# EAGLE design KONNEKTING HW1.1 Rev0 (EAGLE 7.4.0)

## Sheet 1 of 3
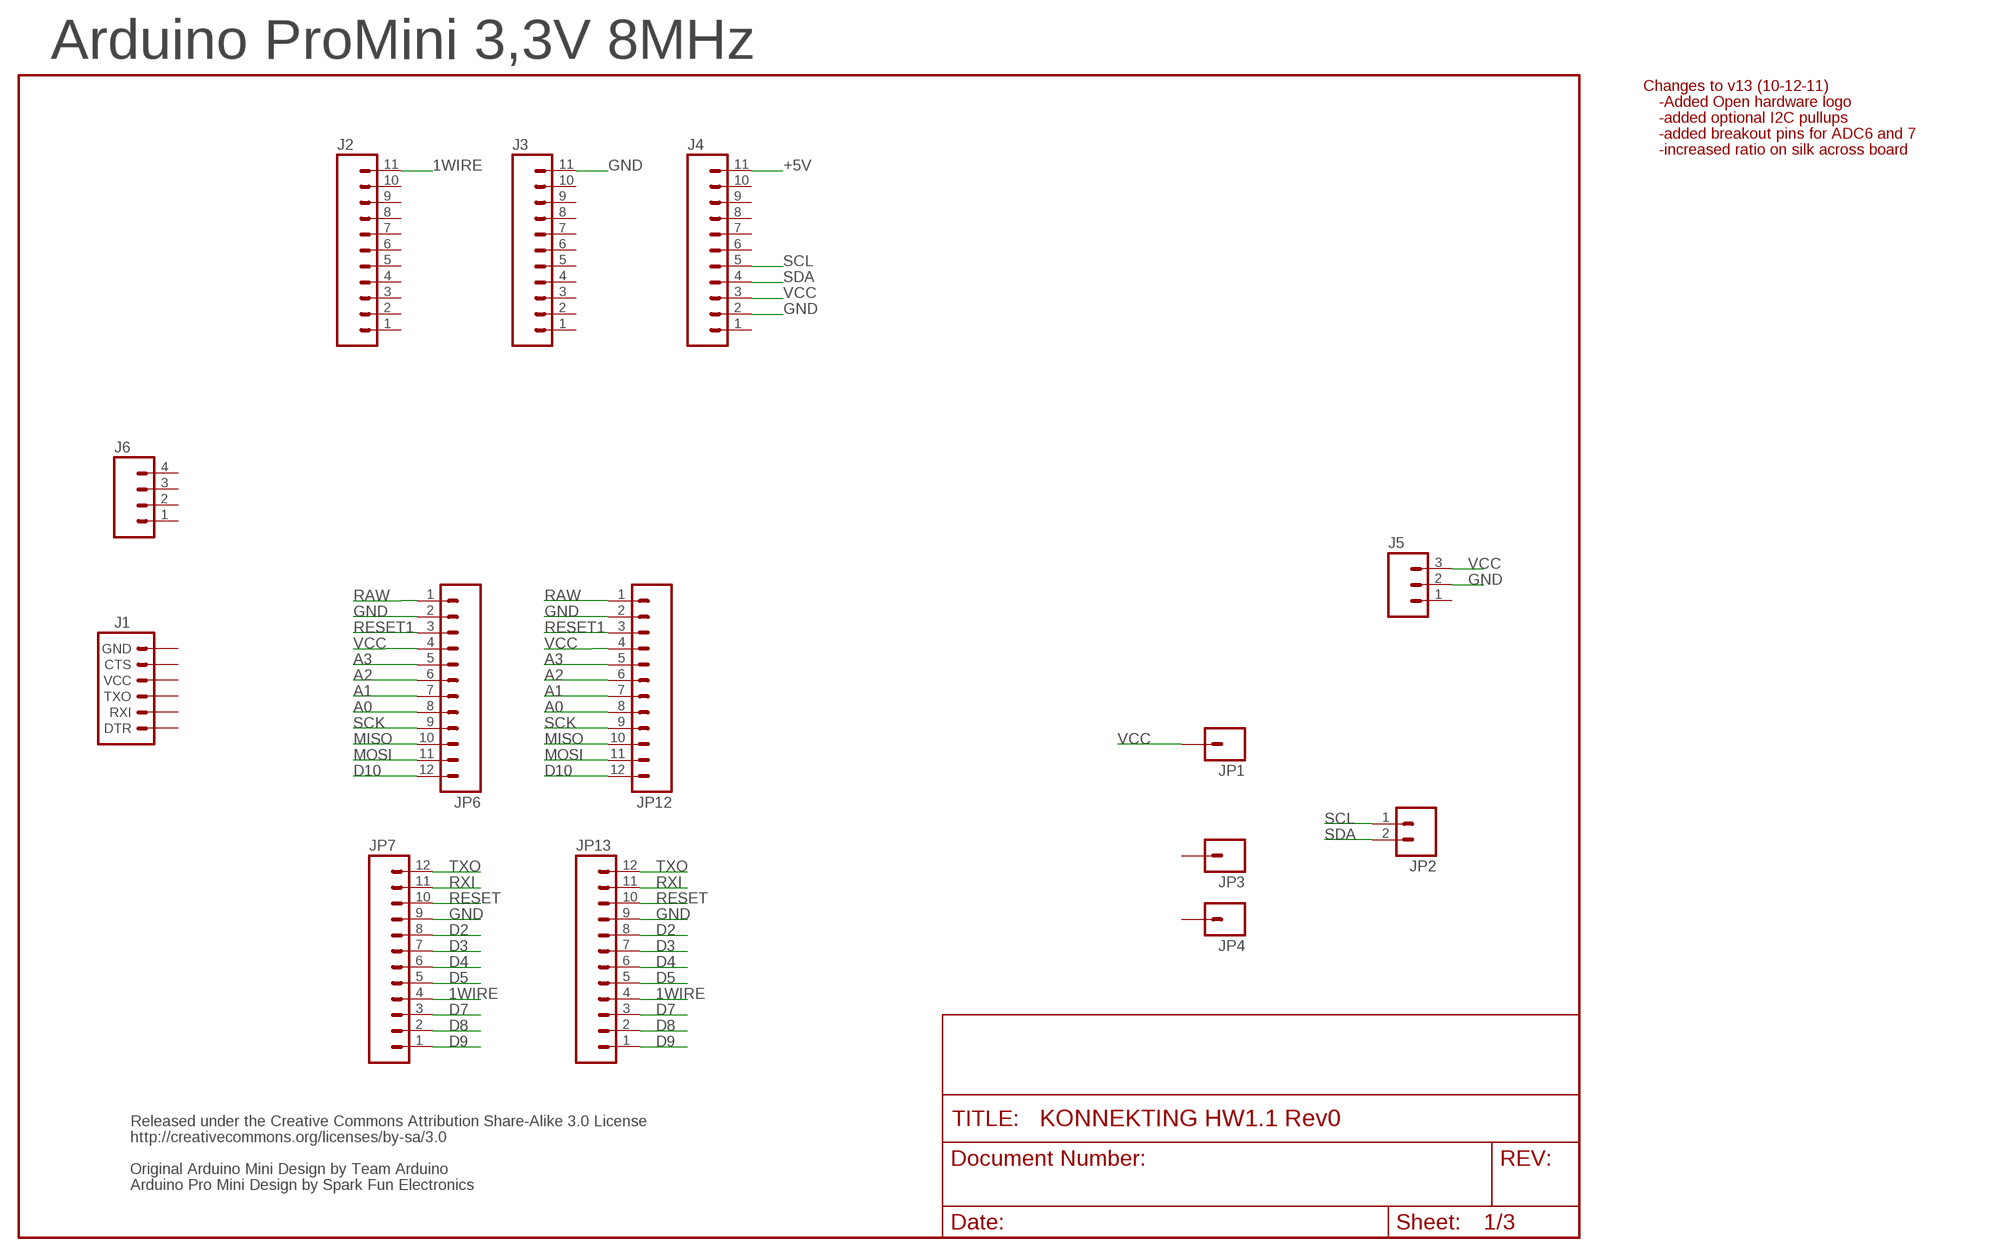
[diagram p0: schematic, sheet 1]

### Parts
J1  ARDUINO_SERIAL_PROGRAMPTH  [1X06]
J2  M11PTH  [1X11]
J3  M11PTH  [1X11]
J4  M11PTH  [1X11]
J5  M03PTH  [1X03]
J6  M04PTH  [1X04]
JP1  M01PTH  [1X01]
JP2  M02PTH  [1X02]
JP3  M01PTH  [1X01]
JP4  M01PTH  [1X01]
JP6  M12PTH  [1X12]
JP7  M12PTH  [1X12]
JP12  M12PTH  [1X12]
JP13  M12PTH  [1X12]

### Nets
1WIRE: J2.11 JP7.4 JP13.4 ; also sheet 3
+5V: J4.11 ; also sheet 2,3
A0: JP6.8 JP12.8
A1: JP6.7 JP12.7
A2: JP6.6 JP12.6
A3: JP6.5 JP12.5
D2: JP7.8 JP13.8 ; also sheet 3
D3: JP7.7 JP13.7 ; also sheet 3
D4: JP7.6 JP13.6
D5: JP7.5 JP13.5
D7: JP7.3 JP13.3 ; also sheet 3
D8: JP7.2 JP13.2 ; also sheet 3
D9: JP7.1 JP13.1 ; also sheet 3
D10: JP6.12 JP12.12
GND: J3.11 J4.2 J5.2 JP6.2 JP7.9 JP12.2 JP13.9 ; also sheet 2,3
MISO: JP6.10 JP12.10
MOSI: JP6.11 JP12.11
RAW: JP6.1 JP12.1
RESET: JP7.10 JP13.10
RESET1: JP6.3 JP12.3
RXI: JP7.11 JP13.11 ; also sheet 3
SCK: JP6.9 JP12.9
SCL: J4.5 JP2.1
SDA: J4.4 JP2.2
TXO: JP7.12 JP13.12 ; also sheet 3
VCC: J4.3 J5.3 JP1.1 JP6.4 JP12.4 ; also sheet 3
Unconnected: J1.1(DTR) J1.2(RXI) J1.3(TXO) J1.4(VCC) J1.5(CTS) J1.6(GND) J2.1 J2.2 J2.3 J2.4 J2.5 J2.6 J2.7 J2.8 J2.9 J2.10 J3.1 J3.2 J3.3 J3.4 J3.5 J3.6 J3.7 J3.8 J3.9 J3.10 J4.1 J4.6 J4.7 J4.8 J4.9 J4.10 J5.1 J6.1 J6.2 J6.3 J6.4 JP3.1 JP4.1

### Notes on the sheet
- Arduino ProMini 3,3V 8MHz
- Changes to v13 (10-12-11)
- -Added Open hardware logo
- -added optional I2C pullups
- -added breakout pins for ADC6 and 7
- -increased ratio on silk across board
- Released under the Creative Commons Attribution Share-Alike 3.0 License
- http://creativecommons.org/licenses/by-sa/3.0
- Original Arduino Mini Design by Team Arduino
- Arduino Pro Mini Design by Spark Fun Electronics

## Sheet 2 of 3
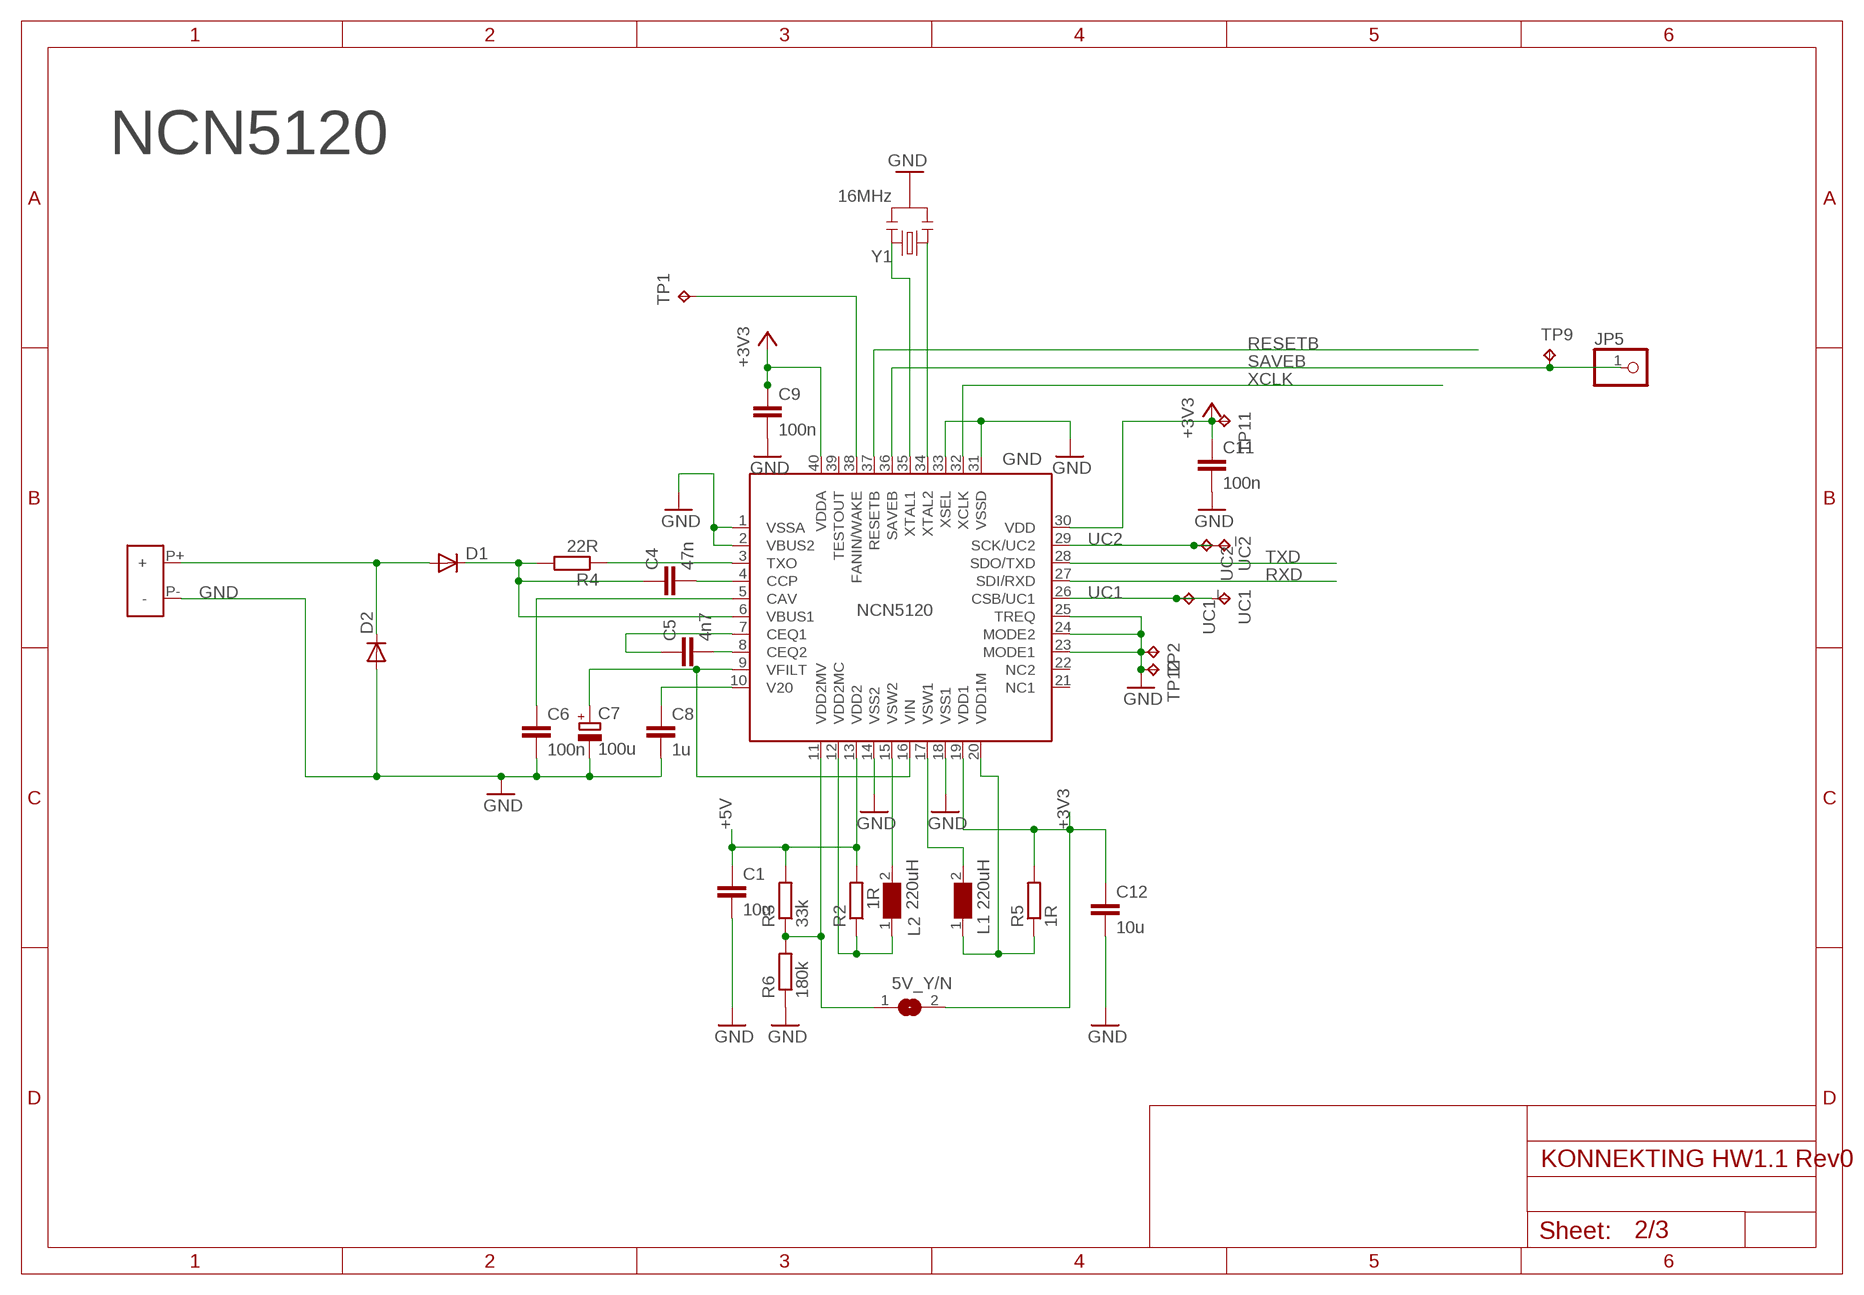
[diagram p1: schematic, sheet 2]

### Parts
5V_Y/N  SJ  [SJ]
C1  10u  C-EUC0805  [C0805]
C4  47n  C-EUC0603  [C0603]
C5  4n7  C-EUC0603  [C0603]
C6  100n  C-EUC0603  [C0603]
C7  100u  CPOL-EUUD-6,3X7,7  [UD-6,3X7,7_NICHICON]
C8  1u  C-EUC0603  [C0603]
C9  100n  C-EUC0603  [C0603]
C11  100n  C-EUC0603  [C0603]
C12  10u  C-EUC0805  [C0805]
D1  DIODESMA-ALT  [SMA-DIODE_ALT]
D2  DIODESMA-ALT  [SMA-DIODE_ALT]
GND  NCN5120_KNX_TRANSCEIVER  [QFN40]
JP5  PINHD-1X1  [1X01]
L1  220uH  WE-PD2_7850  [WE-PD2_7850]
L2  220uH  WE-PD2_7850  [WE-PD2_7850]
R2  1R  R-EU_R0603  [R0603]
R3  33k  R-EU_R0603  [R0603]
R4  22R  R-EU_R2512  [R2512]
R5  1R  R-EU_R0603  [R0603]
R6  180k  R-EU_R0603  [R0603]
TP1  TPTP10SQ  [TP10SQ]
TP2  TPTP09SQ  [TP09SQ]
TP9  TPTP10SQ  [TP10SQ]
TP11  TPTP09SQ  [TP09SQ]
TP12  TPTP09SQ  [TP09SQ]
U$2  KNX_KLEMME  [KNX_KLEMME]
UC1  TPTP09SQ  [TP09SQ]
UC1_  TPTP09SQ  [TP09SQ]
UC2  TPTP09SQ  [TP09SQ]
UC2_  TPTP09SQ  [TP09SQ]
Y1  16MHz  RESONATORSMD  [RESONATOR-SMD]

### Nets
+3V3: 5V_Y/N.2 C9.1 C11.1 C12.1 GND.19(VDD1) GND.30(VDD) GND.40(VDDA) R5.2 TP11.TP ; also sheet 3
+5V: C1.1 GND.13(VDD2) R2.2 R3.2 ; also sheet 1,3
GND: C1.2 C6.2 C7.- C8.2 C9.2 C11.2 C12.2 D2.A GND.1(VSSA) GND.2(VBUS2) GND.14(VSS2) GND.18(VSS1) GND.23(MODE1) GND.24(MODE2) GND.25(TREQ) GND.31(VSSD) GND.33(XSEL) R6.1 TP2.TP TP12.TP U$2.P-(-) Y1.2 ; also sheet 1,3
N$1: 5V_Y/N.1 GND.11(VDD2MV) R3.1 R6.2
N$3: GND.3(TXO) R4.1
N$4: C4.1 D1.C GND.6(VBUS1) R4.2
N$5: C5.1 GND.7(CEQ1)
N$6: C7.+ GND.9(VFILT) GND.16(VIN)
N$7: GND.15(VSW2) L2.2
N$8: C8.1 GND.10(V20)
N$9: C6.1 GND.5(CAV)
N$10: C4.2 GND.4(CCP)
N$11: C5.2 GND.8(CEQ2)
N$12: D1.A D2.C U$2.P+(+)
N$14: GND.38(FANIN/WAKE) TP1.TP
N$16: GND.12(VDD2MC) L2.1 R2.1
N$17: GND.35(XTAL1) Y1.3
N$18: GND.34(XTAL2) Y1.1
N$22: GND.17(VSW1) L1.2
N$24: GND.20(VDD1M) L1.1 R5.1
RESETB: GND.37(RESETB)
RXD: GND.27(SDI/RXD) ; also sheet 3
SAVEB: GND.36(SAVEB) JP5.1 TP9.TP
TXD: GND.28(SDO/TXD) ; also sheet 3
UC1: GND.26(CSB/UC1) UC1.TP UC1_.TP
UC2: GND.29(SCK/UC2) UC2.TP UC2_.TP
XCLK: GND.32(XCLK)
Unconnected: GND.21(NC1) GND.22(NC2) GND.39(TESTOUT)

### Notes on the sheet
- NCN5120

## Sheet 3 of 3
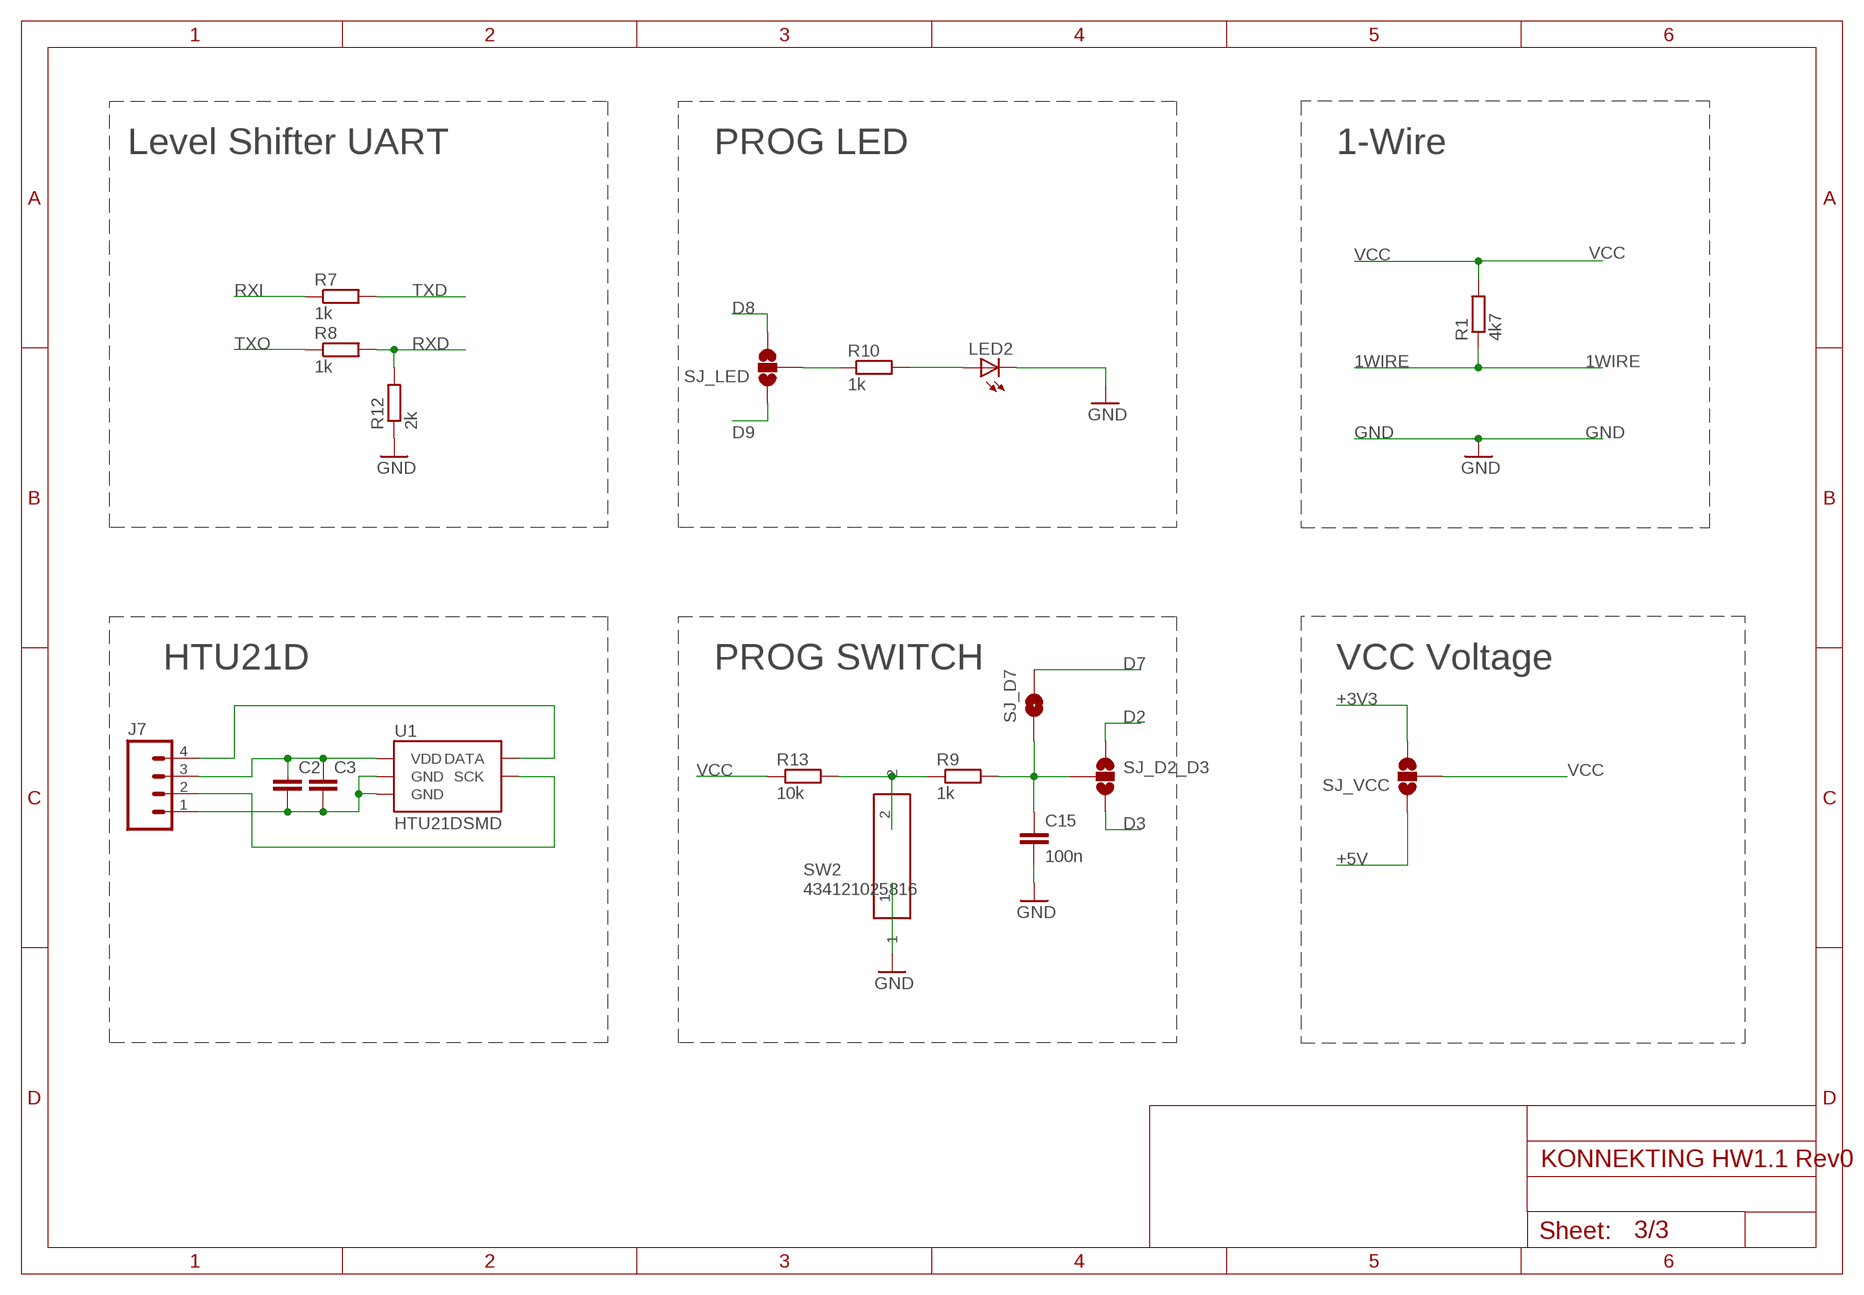
[diagram p2: schematic, sheet 3]

### Parts
C2  CAP0603-CAP  [0603-CAP]
C3  CAP0603-CAP  [0603-CAP]
C15  100n  C-EUC0603  [C0603]
J7  M04PTH  [1X04]
LED2  LEDCHIP-LED0805  [CHIP-LED0805]
R1  4k7  R-EU_R0603  [R0603]
R7  1k  R-EU_R0805  [R0805]
R8  1k  R-EU_R0805  [R0805]
R9  1k  R-EU_R0603  [R0603]
R10  1k  R-EU_R0603  [R0603]
R12  2k  R-EU_R0805  [R0805]
R13  10k  R-EU_R0603  [R0603]
SJ_D2_D3  SOLDERJUMPER_2WAYS  [SJ_3]
SJ_D7  SOLDERJUMPERNO  [SJ_2S-NO]
SJ_LED  SOLDERJUMPER_2WAYS  [SJ_3]
SJ_VCC  SOLDERJUMPER_2WAYS  [SJ_3]
SW2  434121025816  [434121025816]
U1  HTU21DSMD  [HTU21D]

### Nets
1WIRE: R1.1 ; also sheet 1
+3V3: SJ_VCC.3 ; also sheet 2
+5V: SJ_VCC.1 ; also sheet 1,2
D2: SJ_D2_D3.1 ; also sheet 1
D3: SJ_D2_D3.3 ; also sheet 1
D7: SJ_D7.2 ; also sheet 1
D8: SJ_LED.3 ; also sheet 1
D9: SJ_LED.1 ; also sheet 1
GND: C15.2 LED2.C R12.1 SW2.1 ; also sheet 1,2
N$13: R9.1 R13.2 SW2.2
N$15: LED2.A R10.2
N$21: R10.1 SJ_LED.2
N$23: C15.1 R9.2 SJ_D2_D3.2 SJ_D7.1
N$25: C2.2 C3.2 J7.1 U1.7(GND) U1.GND
N$26: J7.4 U1.DATA
N$27: C2.1 C3.1 J7.3 U1.VDD
N$28: J7.2 U1.SCK
RXD: R8.2 R12.2 ; also sheet 2
RXI: R7.1 ; also sheet 1
TXD: R7.2 ; also sheet 2
TXO: R8.1 ; also sheet 1
VCC: R1.2 R13.1 SJ_VCC.2 ; also sheet 1

### Notes on the sheet
- Level Shifter UART | PROG LED | 1-Wire
- HTU21D | PROG SWITCH | VCC Voltage

## Library data of the parts
5V_Y/N = jumper:SJ: SMD solder JUMPER
C1 C4-C6 C8 C9 C11 C12 C15 = rcl:C-EU: CAPACITOR, European symbol
C2 C3 = SparkFun-Capacitors:CAP: Capacitor Standard 0603 ceramic capacitor, and 0.1" leaded capacitor.
C7 = rcl:CPOL-EU: POLARIZED CAPACITOR, European symbol
D1 D2 = SparkFun:DIODE: Diode These are standard reverse protection diodes and small signal diodes. SMA package can handle up to about 1A. SOD-323 can handle about 200mA. What the SOD-323 package when ordering, there are some mfgs out there that are 5-pin packages.
GND = Matthias_1:NCN5120_KNX_TRANSCEIVER
J1 = SparkFun-Connectors:ARDUINO_SERIAL_PROGRAM: FTDI connector footprints
J2-J4 = SparkFun-Connectors:M11: Header 11 Standard 11-pin 0.1" header. Use with straight break away headers (SKU : PRT-00116), right angle break away headers (PRT-00553), swiss pins (PRT-00743), machine pins (PRT-00117), and female headers (PRT-00115).
J5 = SparkFun-Connectors:M03: Header 3 Standard 3-pin 0.1" header. Use with straight break away headers (SKU : PRT-00116), right angle break away headers (PRT-00553), swiss pins (PRT-00743), machine pins (PRT-00117), and female headers (PRT-00115). Molex polarized connector foot print use with SKU : PRT-08232 with associated crimp pins and housings.
J6 J7 = SparkFun-Connectors:M04: Header 4 Standard 4-pin 0.1" header. Use with straight break away headers (SKU : PRT-00116), right angle break away headers (PRT-00553), swiss pins (PRT-00743), machine pins (PRT-00117), and female headers (PRT-00115). Molex polarized connector foot print use with SKU : PRT-08231 with associated crimp pins and housings. 1MM SMD Version SKU: PRT-10208; PROD_ID: CONN-09696
JP1 JP3 JP4 = SparkFun:M01: Header 1 Standard 1-pin 0.1" header. Use with straight break away headers (SKU : PRT-00116), right angle break away headers (PRT-00553), swiss pins (PRT-00743), machine pins (PRT-00117), and female headers (PRT-00115).
JP2 = SparkFun:M02: Header 2 Standard 2-pin 0.1" header. Use with straight break away headers (SKU : PRT-00116), right angle break away headers (PRT-00553), swiss pins (PRT-00743), machine pins (PRT-00117), and female headers (PRT-00115). Molex polarized connector foot print use with SKU : PRT-08233 with associated crimp pins and housings.
JP5 = pinhead:PINHD-1X1: PIN HEADER
JP6 JP7 JP12 JP13 = SparkFun:M12: Header 12 Standard 12-pin 0.1" header. Use with straight break away headers (SKU : PRT-00116), right angle break away headers (PRT-00553), swiss pins (PRT-00743), machine pins (PRT-00117), and female headers (PRT-00115).
L1 L2 = Wuerth_PowerMagnetics:WE-PD2: SMD-Power Inductors WE-PD2 - Industry standard size - Current capability up to 14 A -- Switching regulators with low operating voltages (computer, laptop, mobile phones, pagers) -- Integrated DC/DC-converter -- Is recommended for the application with switching regulators from National Semiconductor, Linear Technology, Texas Instruments and Fairchild Semiconductor -- Perfectly suitable for switching regulators with extremely high efficiency
LED2 = adafruit:LED: LED OSRAM: - CHIPLED LG R971, LG N971, LY N971, LG Q971, LY Q971, LO R971, LY R971 LH N974, LH R974 LS Q976, LO Q976, LY Q976 LO Q996 - Hyper CHIPLED LW Q18S LB Q993, LB Q99A, LB R99A - SideLED LS A670, LO A670, LY A670, LG A670, LP A670 LB A673, LV A673, LT A673, LW A673 LH A674 LY A675 LS A676, LA A676, LO A676, LY A676, LW A676 LS A679, LY A679, LG A679 - Hyper Micro SIDELED® LS Y876, LA Y876, LO Y876, LY Y876 LT Y87S - SmartLED LW L88C, LW L88S LB L89C, LB L89S, LG L890 LS L89K, LO L89K, LY L89K LS L896, LA L896, LO L896, LY L896 - TOPLED LS T670, LO T670, LY T670, LG T670, LP T670 LSG T670, LSP T670, LSY T670, LOP T670, LYG T670 LG T671, LOG T671, LSG T671 LB T673, LV T673, LT T673, LW T673 LH T674 LS T676, LA T676, LO T676, LY T676, LB T676, LH T676, LSB T676, LW T676 LB T67C, LV T67C, LT T67C, LS T67K, LO T67K, LY T67K, LW E67C LS E67B, LA E67B, LO E67B, LY E67B, LB E67C, LV E67C, LT E67C LW T67C LS T679, LY T679, LG T679 LS T770, LO T770, LY T770, LG T770, LP T770 LB T773, LV T773, LT T773, LW T773 LH T774 LS E675, LA E675, LY E675, LS T675 LS T776, LA T776, LO T776, LY T776, LB T776 LHGB T686 LT T68C, LB T68C - Hyper Mini TOPLED® LB M676 - Mini TOPLED Santana® LG M470 LS M47K, LO M47K, LY M47K Source: http://www.osram.convergy.de/
R1-R10 R12 R13 = rcl:R-EU_: RESISTOR, European symbol
SJ_D2_D3 SJ_LED SJ_VCC = SparkFun-Retired:SOLDERJUMPER_2WAY: Solder Jumper 2 way solder jumper
SJ_D7 = SparkFun-Retired:SOLDERJUMPER: Solder Jumper Standard SMD solder jumper. Used to automate production. Two varients : Normally Open and Normally Closed are the same, but have different paste layers. NC will have a large amount of paste and should jumper during reflow.
SW2 = Wuerth_Kurzhubtaster:434121025816: WS-TRS-6x3.8 mm SMD Tact Switch, 2 pins
TP1 TP2 TP9 TP11 TP12 UC1 UC1_ UC2 UC2_ = testpad:TP: Test pad
U1 = SparkFun-Sensors:HTU21D; PROD_ID: IC-11793
U$2 = Matthias_1:KNX_KLEMME
Y1 = SparkFun:RESONATOR: Resonator Small SMD resonator. This is the itty bitty 10/20MHz resonators with built in caps. CSTCE10M0G55 and CSTCE20M0V53. Footprint has been reviewed closely but hasn't been tested yet.

## Net classes
0 default: width 0.203 mm
1 vcc: width 0.254 mm

## Board
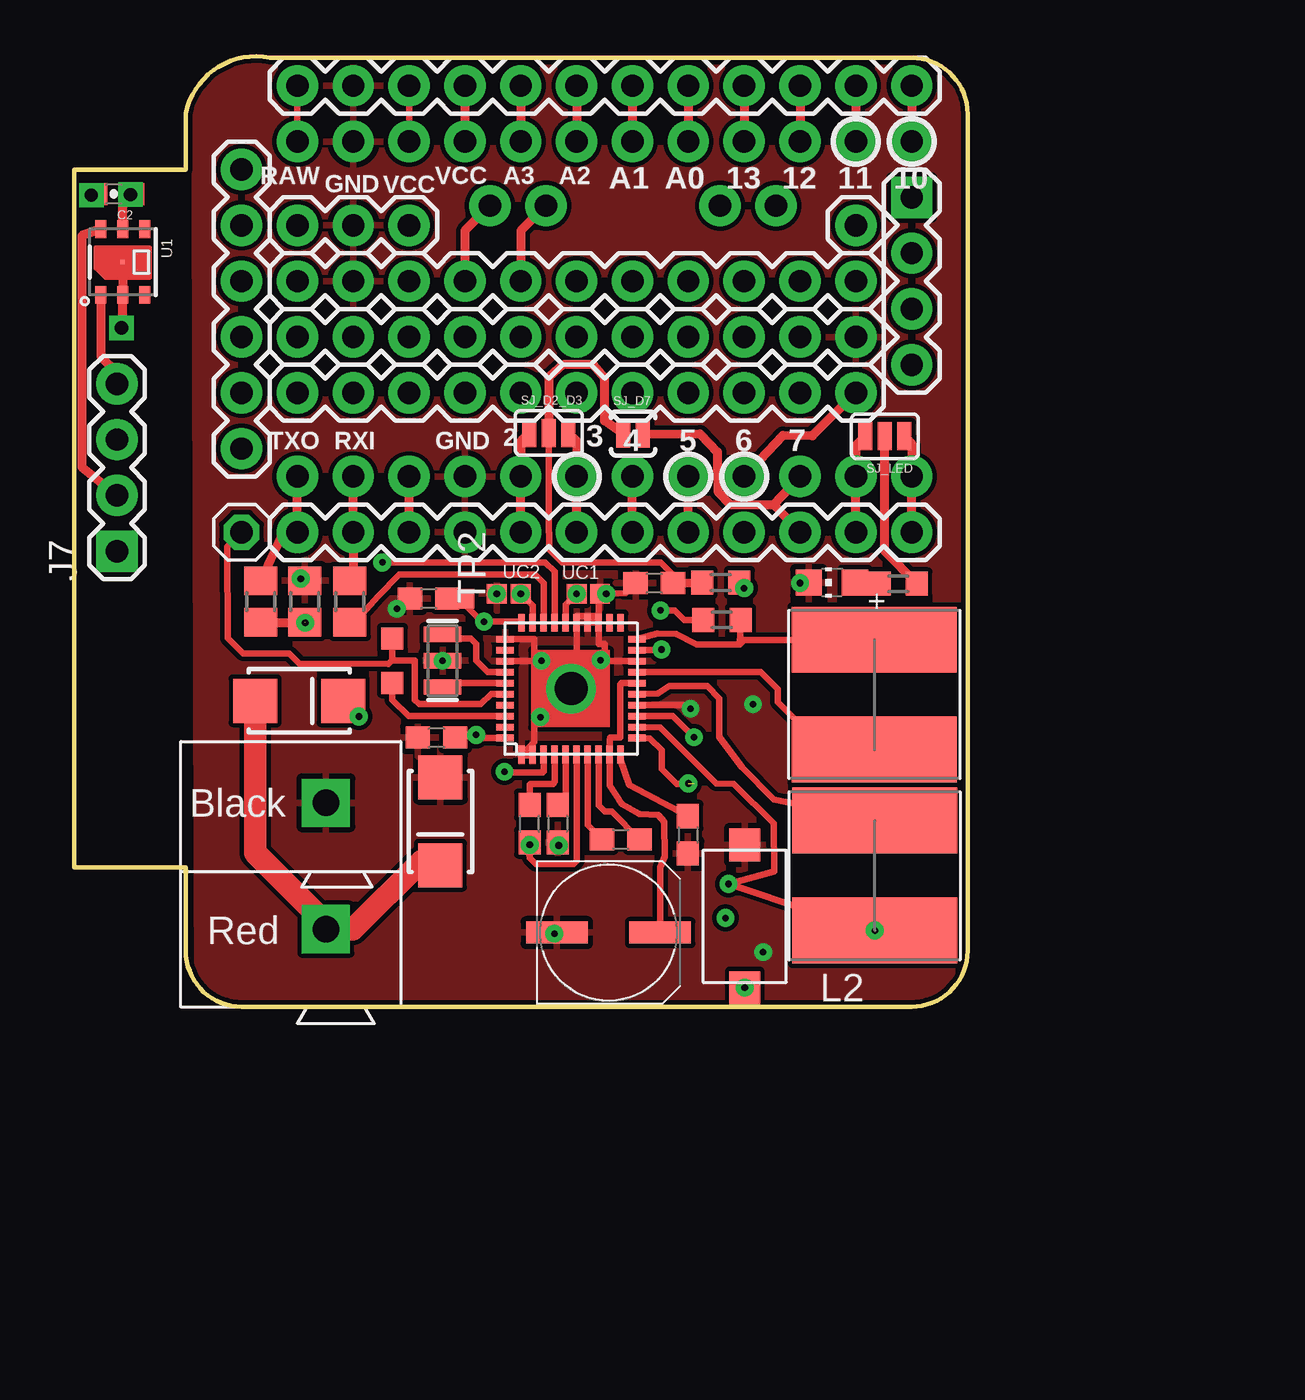
[diagram p3: board, top side]
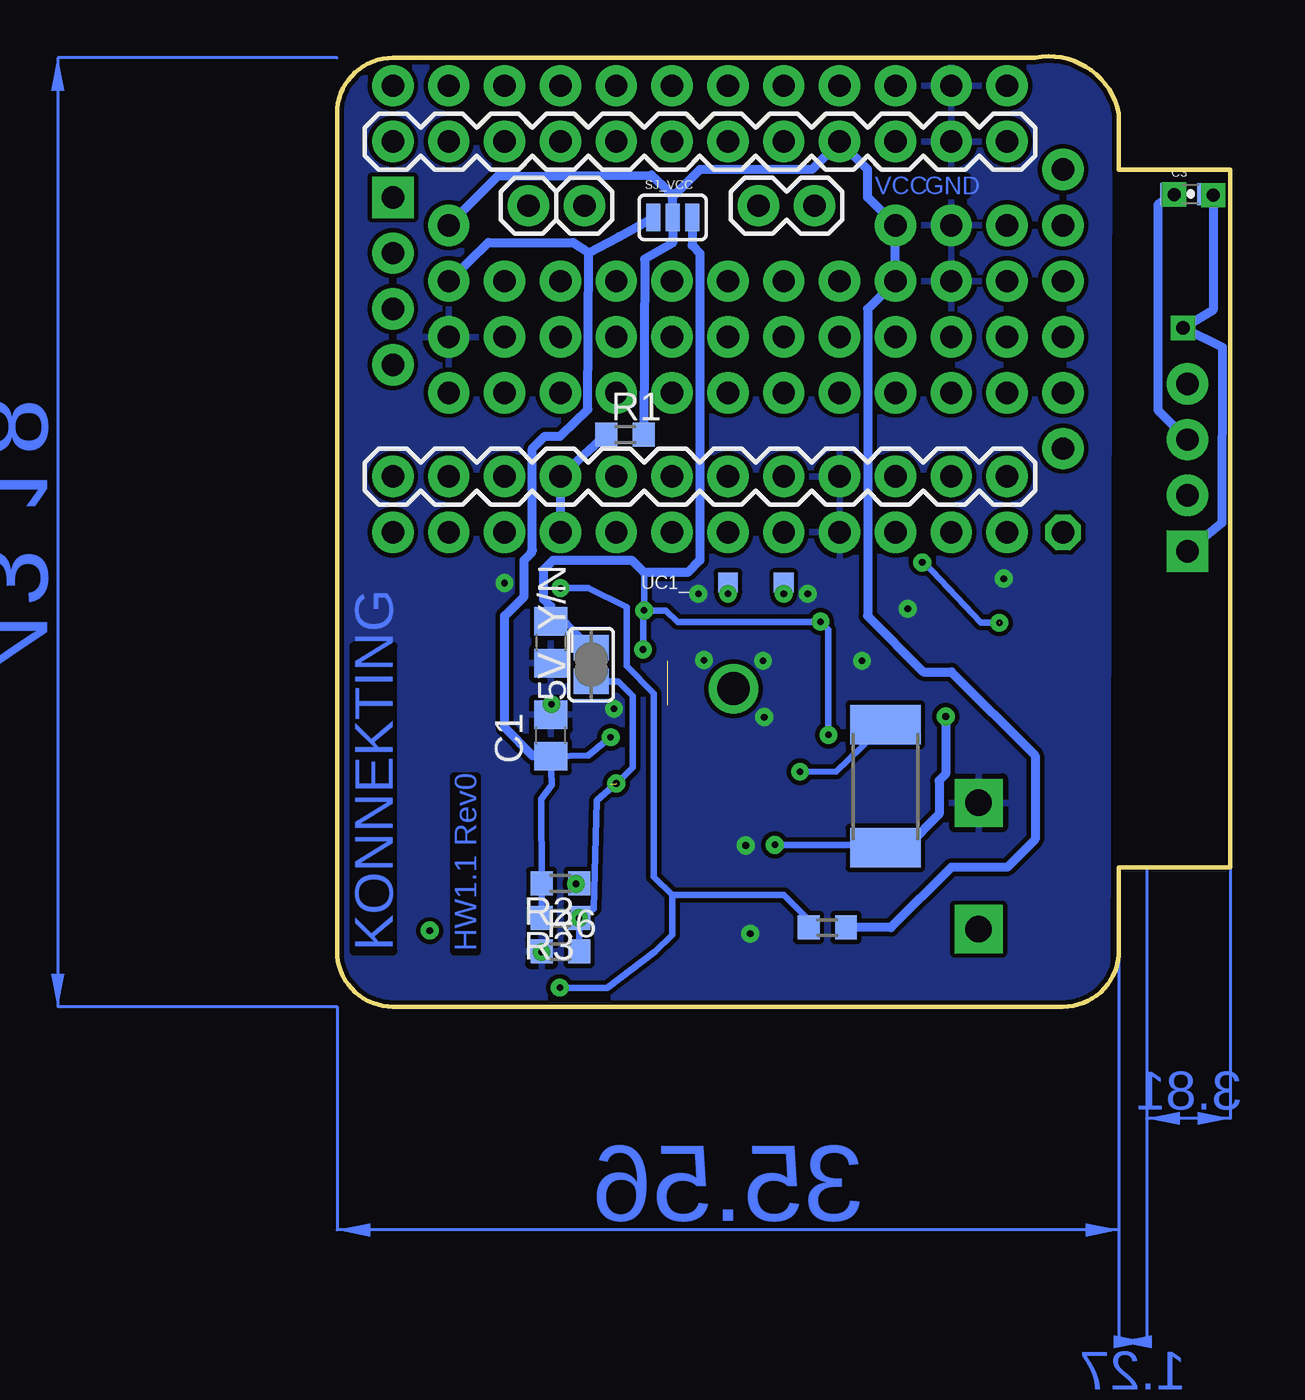
[diagram p4: board, bottom side, seen from below]

Size 40.64 x 43.24 mm. Coordinates in mm from the lower left corner, seen from the top.
Outline: 5.08,2.54 arc90 7.62,0 38.1,0 arc90 40.64,2.54 40.64,40.64 arc90 38.1,43.18 8.89,43.18 arc90 5.08,40.64 5.08,38.1 0,38.1 0,6.35 5.08,6.35 5.08,2.54
Copper layers (1*16): Top 0.035mm / dielectric 1.5mm / Bottom 0.035mm
Design rules "default": minimum track width 8mil, minimum drill 20mil, track to track 8mil, track to pad 8mil, pad to pad 8mil, via to via 8mil, smd to smd 8mil, copper to edge 8mil, drill to drill 8mil, minimum pad ring 12mil, minimum via ring 10mil, stop-mask expansion 4mil, vias tented up to drill 20mil, thermal gap 10mil

### Footprints (pad centres in the part's own frame; a part is rotated, then mirrored left to right if it is on the bottom)
SJ = smd 1.168 x 1.6: 1 -0.762,0; 2 0.762,0
C0805 = smd 1.3 x 1.5: 1 -0.95,0; 2 0.95,0
0603-CAP = smd 1.1 x 1: 1 -0.85,0; 2 0.85,0
C0603 = smd 1.1 x 1: 1 -0.85,0; 2 0.85,0
UD-6,3X7,7_NICHICON = smd 2.8 x 1: + 2.35,0; - -2.35,0
SMA-DIODE_ALT = smd 2 x 2: A -2,0; C 2,0
QFN40 = smd 0.3 x 0.8: 1 -2.25,-3; 2 -1.75,-3; 3 -1.25,-3; 4 -0.75,-3; 5 -0.25,-3; 6 0.25,-3; 7 0.75,-3; 8 1.25,-3; 9 1.75,-3; 10 2.25,-3; 21 2.25,3; 22 1.75,3; 23 1.25,3; 24 0.75,3; 25 0.25,3; 26 -0.25,3; 27 -0.75,3; 28 -1.25,3; 29 -1.75,3; 30 -2.25,3 | smd 0.8 x 0.3: 11 3,-2.25; 12 3,-1.75; 13 3,-1.25; 14 3,-0.75; 15 3,-0.25; 16 3,0.25; 17 3,0.75; 18 3,1.25; 19 3,1.75; 20 3,2.25; 31 -3,2.25; 32 -3,1.75; 33 -3,1.25; 34 -3,0.75; 35 -3,0.25; 36 -3,-0.25; 37 -3,-0.75; 38 -3,-1.25; 39 -3,-1.75; 40 -3,-2.25
1X06 = drill 1.016 pad 1.88: 1 0,0; 2 2.54,0; 3 5.08,0; 4 7.62,0; 5 10.16,0; 6 12.7,0
1X11 = drill 1.016 pad 1.88: 1 0,0; 2 2.54,0; 3 5.08,0; 4 7.62,0; 5 10.16,0; 6 12.7,0; 7 15.24,0; 8 17.78,0; 9 20.32,0; 10 22.86,0; 11 25.4,0
1X03 = drill 1.016 pad 1.88: 1 0,0; 2 2.54,0; 3 5.08,0
1X04 = drill 1.016 pad 1.88 square: 1 0,0 | drill 1.016 pad 1.88: 2 2.54,0; 3 5.08,0; 4 7.62,0
1X01 = drill 1.016 pad 1.88: 1 0,0
1X02 = drill 1.016 pad 1.88: 1 0,0; 2 2.54,0
1X01' = drill 1.016 octagon: 1 0,0
1X12 = drill 1.016 pad 1.88: 1 0,0; 2 2.54,0; 3 5.08,0; 4 7.62,0; 5 10.16,0; 6 12.7,0; 7 15.24,0; 8 17.78,0; 9 20.32,0; 10 22.86,0; 11 25.4,0; 12 27.94,0
WE-PD2_7850 = smd 3 x 7.5: 1 -2.5,0; 2 2.5,0
CHIP-LED0805 = smd 1.2 x 1.2: A 0,-1.05; C 0,1.05
R0603 = smd 1 x 1.1: 1 -0.85,0; 2 0.85,0
R2512 = smd 1.8 x 3.2: 1 -2.8,0; 2 2.8,0
R0805 = smd 1.3 x 1.5: 1 -0.95,0; 2 0.95,0
SJ_3 = smd 0.635 x 1.27: 1 -0.889,0; 2 0,0; 3 0.889,0
SJ_2S-NO = smd 0.635 x 1.27: 1 -0.45,0; 2 0.45,0
434121025816 = smd 1.5 x 1.4: 1 -3.25,0; 2 3.25,0
TP10SQ = smd 1 x 1: TP 0,0
TP09SQ = smd 0.9 x 0.9: TP 0,0
HTU21D = smd 0.2 x 0.2: 7 0,0 | smd 0.8 x 0.5: DATA 1.5,-1; GND 1.5,0; NC@1 -1.5,1; NC@6 1.5,1; SCK -1.5,-1; VDD -1.5,0
KNX_KLEMME = drill 1.2 pad 2.184 square: P+ 0,-3.2; P- 0,2.55
RESONATOR-SMD = smd 0.7 x 1.7: 1 -1.2,0; 2 0,0; 3 1.2,0

### Placement (x,y rotation side)
5V_Y/N  29.08,15.57 90 bottom
C1  30.91,12.34 90 bottom
C2  1.8,36.98 180 top
C3  1.8,36.98 0 bottom
C4  20.73,8.33 90 top
C5  24.87,7.62 0 top
C6  22,8.33 270 top
C7  24.31,3.38 0 top
C8  27.91,7.82 270 top
C9  16.48,12.24 180 top
C11  16.13,18.57 180 top
C12  30.91,16.59 270 bottom
C15  26.39,19.28 180 top
D1  10.24,13.92 0 top
D2  16.66,8.43 270 top
GND  22.61,14.48 0 top
J1  7.62,25.4 90 top
J2  10.16,27.94 0 top
J3  10.16,30.48 0 top
J4  10.16,33.02 0 top
J5  10.16,35.56 0 top
J6  38.1,36.83 270 top
J7  1.96,20.73 90 top
JP1  35.56,35.56 0 top
JP2  21.46,36.45 0 bottom
JP3  31.93,36.45 270 bottom
JP4  29.39,36.45 270 bottom
JP5  [1X01']  7.62,21.59 0 top
JP6  10.16,39.37 180 bottom
JP7  38.1,24.13 0 bottom
JP12  10.16,41.91 0 top
JP13  38.1,21.59 180 top
L1  36.4,14.2 270 top
L2  36.42,5.97 90 top
LED2  34.47,19.3 90 top
R1  27.53,26.04 0 bottom
R2  30.48,5.61 180 bottom
R3  30.48,4.04 180 bottom
R4  15.7,10.03 270 bottom
R5  29.46,17.6 180 top
R6  30.48,2.51 0 bottom
R7  12.55,18.44 270 top
R8  8.48,18.44 270 top
R9  29.41,19.3 180 top
R10  37.49,19.25 180 top
R12  10.49,18.44 270 top
R13  18.34,3.61 180 bottom
SJ_D2_D3  21.59,26.11 0 top
SJ_D7  25.43,26.09 0 top
SJ_LED  36.88,25.96 180 top
SJ_VCC  25.37,35.92 0 bottom
SW2  30.51,4.11 270 top
TP1  14.48,14.73 0 top
TP2  19.23,18.8 90 top
TP9  14.48,16.76 0 top
TP11  17.75,18.57 0 top
TP12  23.93,18.8 0 top
U1  2.21,33.88 270 top
U$2  11.46,6.73 0 top
UC1  22.86,18.8 0 top
UC1_  22.86,19.3 0 bottom
UC2  20.32,18.8 0 top
UC2_  20.32,19.3 0 bottom
Y1  16.76,15.75 270 top

### Tracks (layer width: path | path; a pad name or v marks a point on that pad's centre or on a via)
1WIRE
  Top 0.406: JP7.4 32.26,26.01 33.58,25.98 J2.11
  Bottom 0.406: R1.1 JP7.4 JP13.4
+3V3  (via drill 0.3)
  Top 0.305: GND.40 18.51,12.23 v18.29,12.37 C9.1 17.27,12.45 | 26.54,18.06 v26.67,18.03 27.33,18.03 27.76,17.6 R5.2 | C11.1 17.53,18.54 18.54,17.53 v18.64,17.53 20.31,17.53 GND.30 | GND.19 26.69,16.23 arc90 v26.72,16.26
  Top 0.406: TP11.TP 17.53,18.54
  Bottom 0.305: v18.29,12.37 18.29,17.17 v18.64,17.53 18.64,17.5 25.15,17.5 25.68,18.03 v26.67,18.03 | v26.72,16.26 26.72,17.98 arc90 v26.67,18.03 | 26.67,19.76 v26.67,18.03 | 5V_Y/N.2 30.48,17.78 C12.1
  Bottom 0.406: SJ_VCC.3 24.49,34.65 24.13,34.29 24.13,20.32 24.69,19.76 26.67,19.76 27.2,20.3 27.23,20.3 27.25,20.32 30.81,20.32 31.24,19.89 31.24,18.54 30.91,18.21 C12.1
+5V  (via drill 0.3)
  Top 0.305: GND.13 27.23,13.23 v28.19,12.27
  Bottom 0.305: v28.19,12.27 29.21,11.43 C1.1 30.88,10.09 31.34,9.45 R2.2 R3.2
  Bottom 0.406: C1.1 30.95,11.43 31.75,11.43 33.02,12.7 33.02,17.78 32.13,18.67 32.13,20.32 31.8,20.65 31.8,20.73 31.75,20.78 31.75,25.4 31.19,25.96 30.51,25.96 30.43,26.04 29.23,27.18 29.19,34.31 | 29.19,34.31 27.84,35.03 SJ_VCC.1 | J4.11 33.76,34.77 29.9,34.77 29.19,34.31
A0
  Top 0.406: JP12.8 JP6.8
A1
  Top 0.406: JP12.7 JP6.7
A2
  Top 0.406: JP12.6 JP6.6
A3
  Top 0.406: JP12.5 JP6.5
D2
  Top 0.406: JP13.8 JP7.8 20.32,25.73 SJ_D2_D3.1
D3
  Top 0.406: JP13.7 JP7.7 22.86,25.73 SJ_D2_D3.3
D4
  Top 0.406: JP13.6 JP7.6
D5
  Top 0.406: JP13.5 JP7.5
D7
  Top 0.406: SJ_D7.2 28.47,26.06 29.26,25.25 29.29,23.44 29.84,22.86 31.83,22.86 | 31.83,22.86 JP7.3 | JP13.3 31.83,22.86
D8
  Top 0.406: JP13.2 JP7.2 35.56,25.53 SJ_LED.3
D9
  Top 0.406: JP13.1 JP7.1 38.1,25.63 SJ_LED.1
D10
  Top 0.406: JP12.12 JP6.12
GND  (via drill 0.3)  (1 unrouted)
  Top 0.305: GND.23 23.86,16.51 24.13,16.51 24.13,15.73 | 24.13,15.24 24.13,15.73 | 24.13,15.73 GND.18 | GND.23 GND.24 | GND.23 23.86,17.78 | 23.86,17.78 22.86,17.78 22.86,15.73 20.93,15.73 | 20.93,15.73 GND.33 | GND.31 20.93,16.74 20.93,15.73 | 26.45,13.73 GND.14 27.88,13.73 28.09,13.51 | GND.2 20.81,11.43 20.32,11.43 20.93,12.04 20.93,15.73 | 23.86,17.78 23.86,18.5 TP12.TP 25.08,18.82 C15.2
  other vias: 22.05,7.34 16.76,15.75 10.31,19.48 14.68,18.11 28.04,13.56 21.21,13.18 21.26,15.75 23.95,15.77 33.02,19.28 30.89,13.77 21.84,3.33 31.34,2.49 24.21,18.8 19.23,18.8
  pour Top: 40.64,40.34 40.64,2.84 arc-90 37.8,0 5.61,-0.08 5.49,36.8 5.51,40.47 arc-90 7.87,43.21 37.8,43.18 arc-90
  pour Bottom: 5.61,-0.08 5.51,40.19 arc-90 7.92,43.18 37.8,43.18 arc-90 40.64,40.34 40.64,2.84 arc-90 37.8,0
MISO
  Top 0.406: JP12.10 JP6.10
MOSI
  Top 0.406: JP12.11 JP6.11
N$1  (via drill 0.3)  (2 unrouted)
  Top 0.305: GND.11 26.19,12.22 26.72,11.68 26.72,10.82 27.41,10.13 28.22,10.13 | 29.54,4.04 R3.1
  Bottom 0.305: R6.2 R3.1 28.96,4.45 28.82,9.39 v27.94,10.16 | 5V_Y/N.1 27.84,14.81 27.18,14.15 27.18,10.9 27.94,10.13
  other vias: 29.63,4.04
N$2  (via drill 1.5)
  other vias: 22.61,14.48
N$3  (via drill 0.3)
  Top 0.305: GND.3 21.36,10.71 21.31,10.67 19.96,10.67 v19.58,10.69
  Bottom 0.305: v19.58,10.69 17.93,10.7 R4.1
N$4  (via drill 0.3)
  Top 0.305: GND.6 22.86,6.62 22.73,6.5 21.01,6.5 20.73,6.78 | 20.73,6.78 C4.1 | v20.73,7.37 20.68,7.06 20.73,6.78
  Top 0.61: D1.C 12.7,13.46 v12.95,13.21
  Bottom 0.305: R4.2 16.35,7.36 v20.73,7.37
  Bottom 0.406: v12.95,13.21 12.95,10.59 13.26,10.29 13.26,8.76 14.68,7.32 15.3,7.26 R4.2
N$5
  Top 0.305: GND.7 23.36,8.28 C5.1
N$6
  Top 0.305: GND.16 24.9,14.73 24.84,14.66 24.84,12.24 24.38,12.24 24.36,12.16 GND.9 24.36,10.06 24.92,9.22 25.7,8.76 26.57,8.74 26.85,8.41 26.87,6.83 26.67,6.35 C7.+
N$7
  Top 0.305: GND.15 26.54,14.25 27.08,14.61 28.8,14.61 29.34,14.02 29.34,12.27 30.4,10.9 31.83,9.42 L2.2
N$8
  Top 0.305: GND.10 24.86,11.21 25.25,10.08 C8.1
N$9
  Top 0.305: GND.5 22.36,9.66 21.84,9.14 C6.1
N$10
  Top 0.305: GND.4 21.86,10.25 21.79,10.13 20.78,10.13 20.73,10.11 C4.2
N$11
  Top 0.305: GND.8 23.86,9.16 24.13,8.89 24.45,8.89 C5.2
N$12
  Top 0.305: D2.C 15.82,6.63
  Top 1.016: 15.82,6.63 12.68,3.53 U$2.P+ 11.43,3.81 8.24,7 D1.A
N$13  (via drill 0.3)
  Top 0.305: R9.1 30.26,19.27 v30.48,19.05
  Bottom 0.305: v30.48,19.05 29.21,19.05 27.46,18.19 27.46,15.49 26.24,14.25 26.24,5.92 25.4,5.08 | SW2.2 28.34,0.86 26.16,2.52 25.4,3.28 25.4,5.08 | R13.2 19.19,3.95 20.32,5.08 25.4,5.08
  other vias: 30.51,0.86
N$14
  Top 0.305: GND.38 15.22,13.23 14.48,13.97 TP1.TP
N$15
  Top 0.406: LED2.A 35.59,19.38 R10.2
N$16  (via drill 0.3)
  Top 0.305: GND.12 26.67,12.7 29.21,10.16 30,10.13 31.83,8.33 31.85,6.15 v29.77,5.59 33.58,4.32 L2.1
  Bottom 0.305: v29.77,5.59 29.74,5.61 R2.1
  other vias: 36.42,3.47
N$17
  Top 0.305: GND.35 16.94,14.73 Y1.3
N$18
  Top 0.305: GND.34 18.81,15.23 18.29,15.75 18.29,16.51 18.03,16.76 16.95,16.76 Y1.1
N$21
  Top 0.406: R10.1 38.34,19.27 36.88,20.73 SJ_LED.2
N$22
  Top 0.305: GND.17 31.23,15.23 32,14.45 32,13.87 33.05,12.83 35.27,12.83 L1.2
N$23
  Top 0.305: SJ_D2_D3.2 21.59,21.59 21.62,21.57 21.62,20.8 22.2,20.22 26.7,20.22 27.24,19.67 C15.1
  Top 0.406: C15.1 R9.2 | SJ_D7.1 24.13,26.67 24.13,28.6 23.62,29.21 22.23,29.21 21.59,28.65 SJ_D2_D3.2
N$24
  Top 0.305: GND.20 26.52,16.99 27.38,16.97 28.32,16.48 30.28,16.48 | 30.28,16.48 R5.1 | 30.28,16.48 30.49,16.7 L1.1
N$25  (via drill 0.6)
  Top 0.406: C3.2 v0.79,36.93 | v2.16,30.89 2.21,31.17 U1.GND U1.7
  Bottom 0.406: C3.2 1.08,37.23 v0.79,36.93 0.79,31.7 v2.16,30.89 0.36,30 0.38,22.02 J7.1
N$26
  Top 0.406: U1.DATA 1.22,29.59 1.96,28.85 J7.4
N$27  (via drill 0.6)
  Top 0.406: C3.1 2.65,37.05 v2.56,36.96 2.21,36.4 U1.VDD
  Bottom 0.406: J7.3 3.3,27.15 3.3,36.49 C3.1 v2.56,36.96
N$28
  Top 0.406: U1.SCK 0.36,35.08 0.36,24.56 J7.2
RAW
  Top 0.305: JP12.1 JP6.1
RESET
  Top 0.406: JP13.10 JP7.10
RESET1
  Top 0.305: JP12.3 JP6.3
RXD  (via drill 0.3)  (1 unrouted)
  Top 0.305: GND.27 21.86,19.8 21.44,20.22 v14.02,20.22
  Top 0.406: R8.2 v10.52,17.48
  Bottom 0.305: v14.02,20.22 13.92,20.22 11.35,17.48 v10.52,17.48
RXI
  Top 0.406: JP7.11 JP13.11 12.7,19.91 R7.1
SAVEB
  Top 0.305: GND.36 18.98,14.23 18.49,13.77 15.7,13.77 15.49,13.97 15.49,15.75 14.48,15.75 TP9.TP 14.48,15.77 14.3,15.6 10.24,15.62 9.78,16.08 7.7,16.08 6.99,16.79 6.96,20.93 JP5.1
SCK
  Top 0.406: JP12.9 JP6.9
SCL
  Top 0.406: JP2.1 20.32,35.31 J4.5
SDA
  Top 0.406: JP2.2 17.78,35.31 J4.4
TXD
  Top 0.305: GND.28 21.36,19.28 20.98,19.66 14.78,19.66 13.84,18.69 13.28,18.09 12.98,17.78 12.71,17.7 R7.2
TXO
  Top 0.406: R8.1 9.42,21.39 9.63,21.59 JP13.12 JP7.12
UC1  (via drill 0.3)
  Top 0.305: GND.26 22.36,18.29 UC1.TP
  Bottom 0.305: UC1.TP 23.11,19.05 UC1_.TP
  other vias: 22.86,18.8
UC2  (via drill 0.3)
  Top 0.305: GND.29 20.86,18.26 UC2.TP
  Bottom 0.305: UC2.TP 20.57,19.05 UC2_.TP
  other vias: 20.32,18.8
VCC
  Top 0.406: JP12.4 JP6.4
  Bottom 0.406: R13.1 15.44,3.61 12.7,6.35 10.16,6.35 8.89,7.62 8.89,11.43 12.7,15.24 13.97,15.24 16.51,17.78 16.51,31.75 J4.3 J5.3 16.51,36.83 16.51,38.1 JP6.4 19.05,38.1 24.13,38.1 25.32,36.91 | 25.32,36.91 25.4,36.83 SJ_VCC.2 25.38,34.75 26.65,34.01 R1.2 | JP1.1 33.33,37.8 26.34,37.85 25.32,36.91
(copper drawn outside any net)
  shapes: Bottom area x4

### Text on the board
Bottom: GND | VCC | HW1.1 Rev0 | KONNEKTING
tPlace: Released under the Creative Commons Attribution Share-Alike 3.0 License | http://creativecommons.org/licenses/by-sa/3.0 | RAW | GND | VCC | VCC | A3 | A2 | A1 | A0 | 13 | 12 | 11 | 10 | TXO | RXI | GND | 2 | 3 | 4 | 5 | 6 | 7